# EAGLE design momentary 2 way switch (EAGLE 6.3)
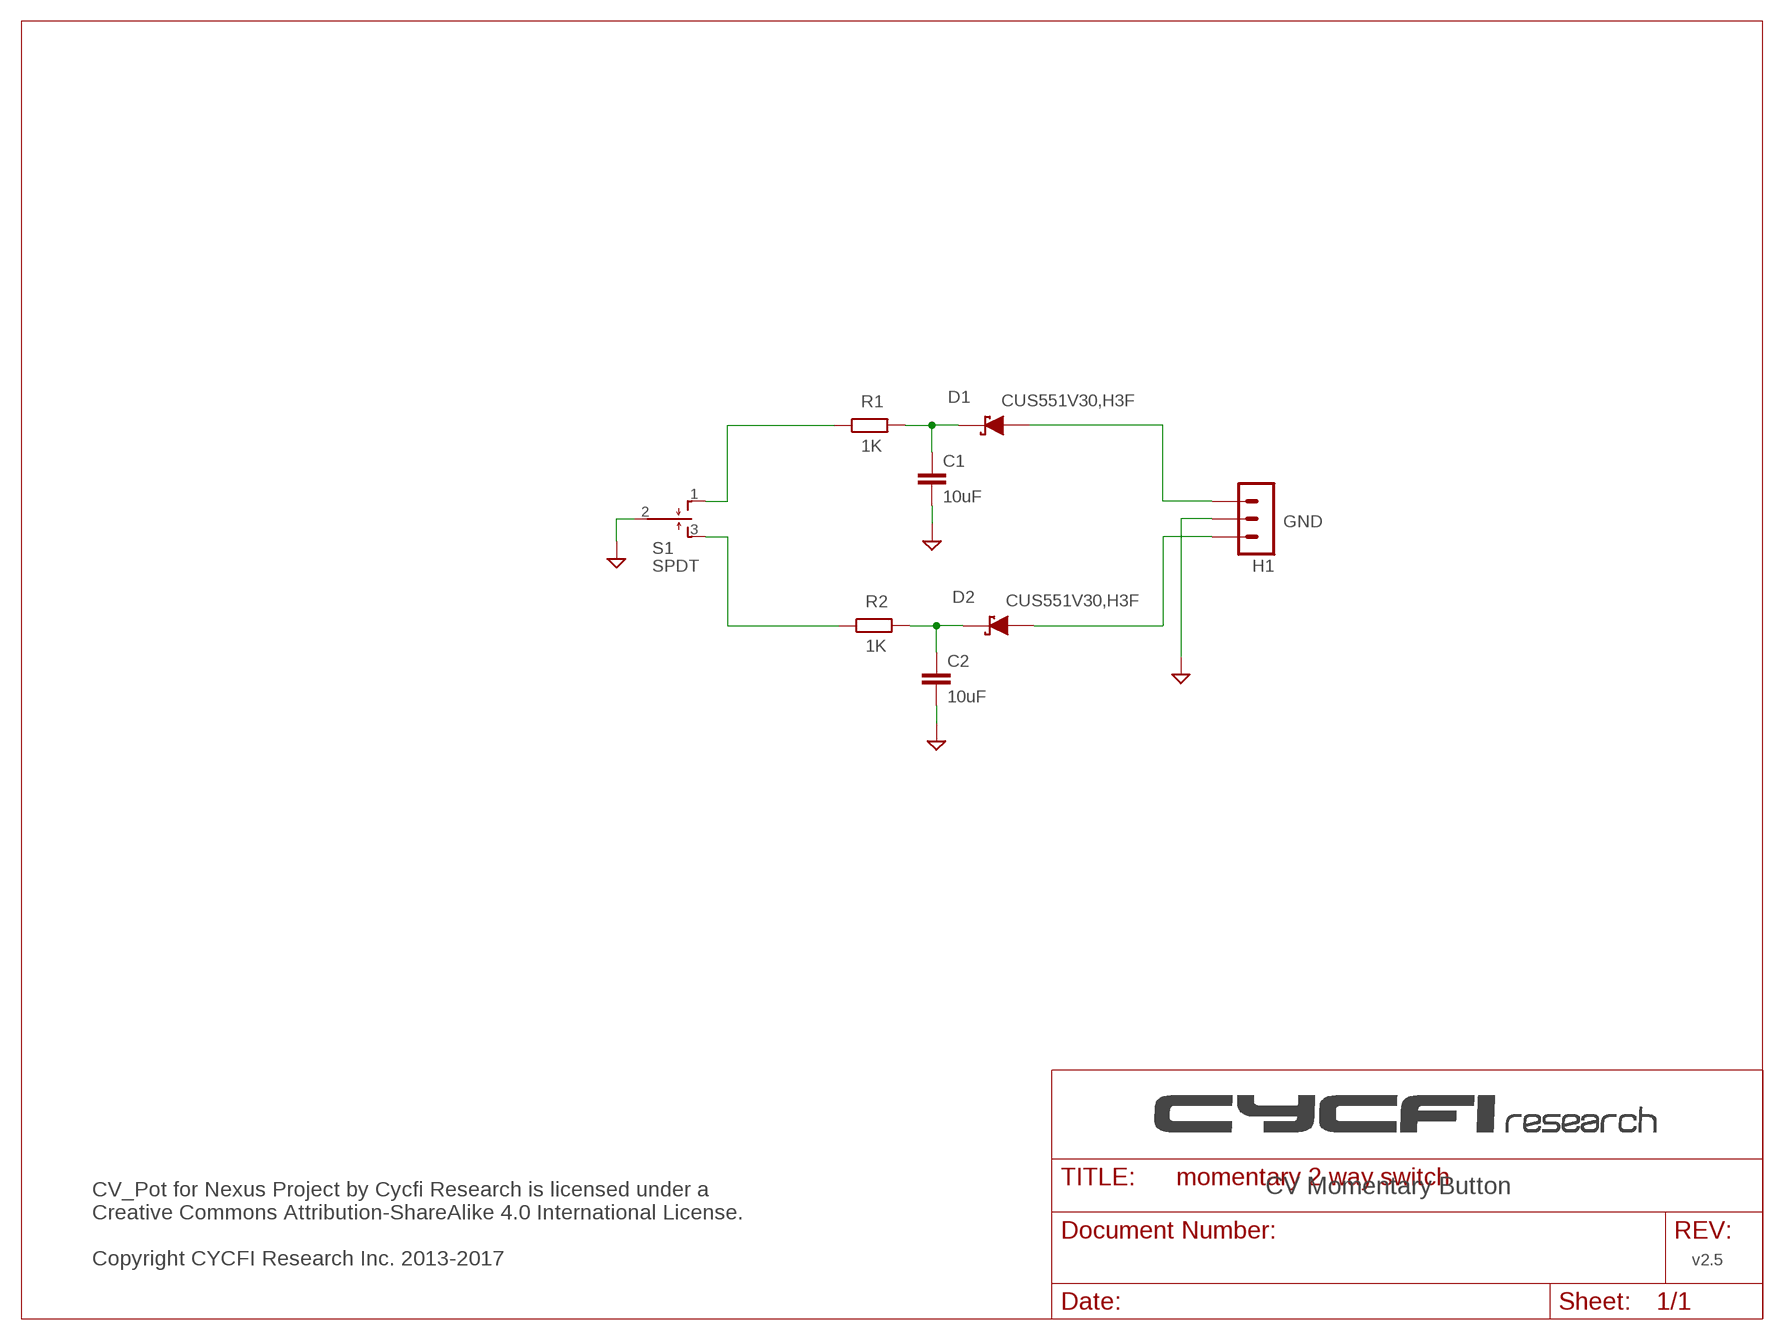
[diagram p0: schematic, sheet 1]

## Parts
C1  10uF  C-EUC0603  [C0603]
C2  10uF  C-EUC0603  [C0603]
D1  CUS551V30,H3F  D_SCHOTTKYL  [SOD-323]
D2  CUS551V30,H3F  D_SCHOTTKYL  [SOD-323]
H1  3PIN-SMD-2.54MM  [3P-SMD-2.54MM]
R1  1K  R-EU_R0402  [R0402]
R2  1K  R-EU_R0402  [R0402]
S1  SPDT  [SPDT]

## Nets
GND: C1.2 C2.2 H1.P$2 S1.2(P)
N$1: C1.1 D1.2(C) R1.2
N$2: R1.1 S1.1(O)
N$3: C2.1 D2.2(C) R2.2
N$4: R2.1 S1.3(S)
SW1: D2.1(A) H1.P$3
SW2: D1.1(A) H1.P$1

## Notes on the sheet
- GND
- CV Momentary Button
- CV_Pot for Nexus Project by Cycfi Research is licensed under a 
  Creative Commons Attribution-ShareAlike 4.0 International License. 
  
  Copyright CYCFI Research Inc. 2013-2017
- v2.5

## Library data of the parts
C1 C2 = resistor:C-EU: CAPACITOR, European symbol
D1 D2 = m-pad-2.1:D_SCHOTTKY: Schottky diodes in various packages
H1 = CYCFI_Con:3PIN-SMD-2.54MM
R1 R2 = resistor:R-EU_: RESISTOR, European symbol
S1 = switch:SPDT

## Board
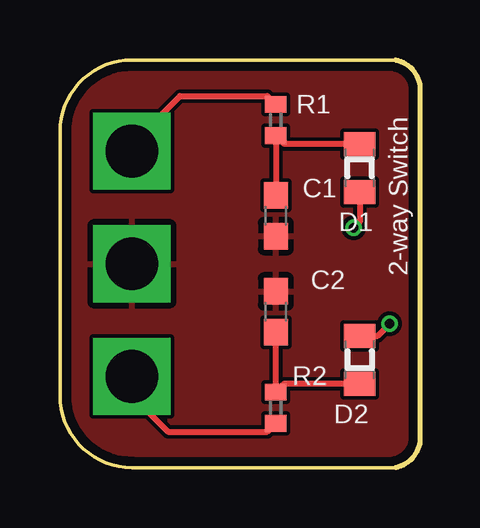
[diagram p1: board, top side]
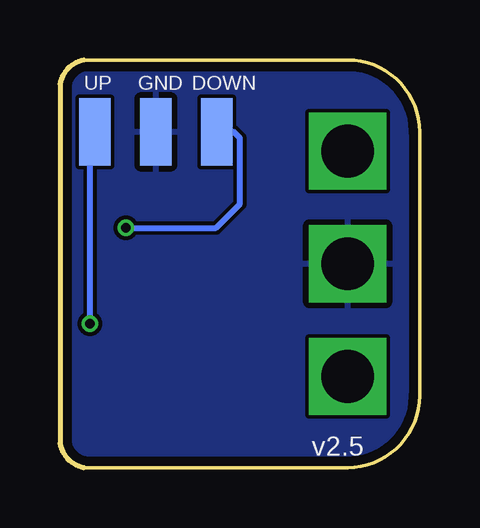
[diagram p2: board, bottom side, seen from below]

Size 15 x 17 mm. Coordinates in mm from the lower left corner, seen from the top.
Outline: 3,0 14,0 arc67 15,1 15,16 arc67 14,17 3,17 arc90 0,14 0,3 arc90 3,0
Copper layers (1*16): Top 0.035mm / dielectric 1.6mm / Bottom 0.035mm
Design rules "Elecrow_2-layer_PCB_eagle_rule *": minimum track width 6mil, minimum drill 12mil, track to track 6mil, track to pad 8mil, pad to pad 12mil, via to via 12mil, smd to smd 0mil, copper to edge 15mil, drill to drill 10mil, minimum pad ring 6mil, minimum via ring 6mil, stop-mask expansion 0mil, vias tented up to drill 100mil, thermal gap 10mil

### Footprints (pad centres in the part's own frame; a part is rotated, then mirrored left to right if it is on the bottom)
C0603 = smd 1.1 x 1: 1 -0.85,0; 2 0.85,0
SOD-323 = smd 1 x 1.3: 1 -1,0; 2 1,0
3P-SMD-2.54MM = smd 1.3 x 2.8: P$1 -2.54,0; P$2 0,0; P$3 2.54,0
R0402 = smd 0.7 x 0.9: 1 -0.65,0; 2 0.65,0
SPDT = drill 2.2 square: 1 -4.7,0; 2 0,0; 3 4.7,0

### Placement (x,y rotation side)
C1  9,10.5 270 top
C2  9,6.5 90 top
D1  12.5,12.5 90 top
D2  12.5,4.5 270 top
H1  11,14 180 bottom
R1  9,14.5 270 top
R2  9,2.5 90 top
S1  3,8.5 270 top

### Tracks (layer width: path | path; a pad name or v marks a point on that pad's centre or on a via)
GND
  pour Bottom: 0,0 0,17 15,17 15,0
  pour Top: 0,0 0,17 15,17 15,0
N$1
  Top 0.254: C1.1 R1.2 9.35,13.5 D1.2
N$2
  Top 0.254: S1.1 3,13.5 5,15.5 8.65,15.5 R1.1
N$3
  Top 0.254: C2.1 R2.2 9.35,3.5 D2.2
N$4
  Top 0.254: S1.3 3,3 4.5,1.5 8.65,1.5 R2.1
SW1  (via drill 0.4)
  Top 0.254: D2.1 13.25,5.5 v13.75,6
  Bottom 0.254: v13.75,6 13.75,13.79 H1.P$3
SW2  (via drill 0.4)
  Top 0.254: D1.1 12.5,10.25 v12.25,10
  Bottom 0.254: v12.25,10 8.5,10 7.5,11 7.5,13.75 7.75,14 H1.P$1

### Text on the board
tNames: 2-way Switch
bNames: DOWN | GND | UP | v2.5